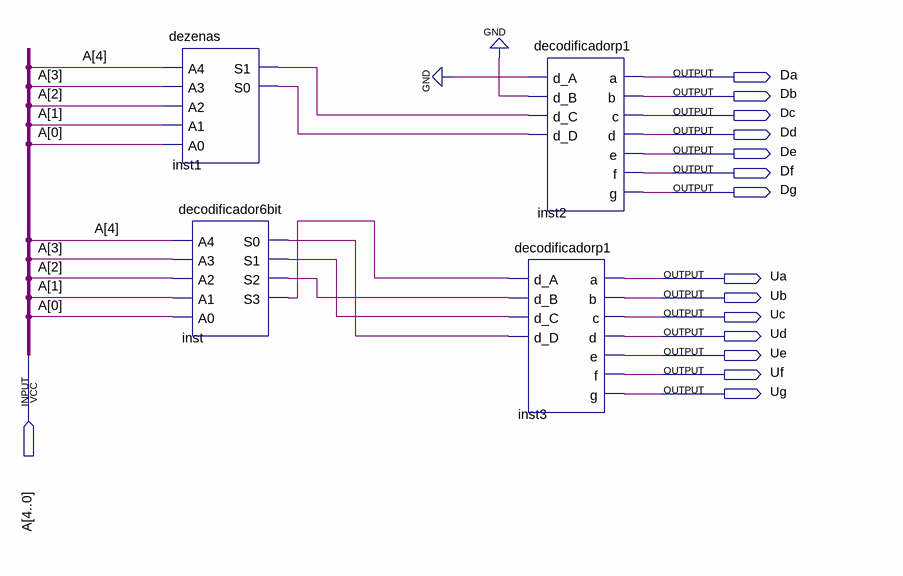
[diagram p0: schematic sheet]
// Quartus schematic DecodificadorCompleto.bdf as structural Verilog: 4 symbols, 15 pins
module DecodificadorCompleto (
  input  [4:0] A,
  output Da,
  output Db,
  output Dc,
  output Dd,
  output De,
  output Df,
  output Dg,
  output Ua,
  output Ub,
  output Uc,
  output Ud,
  output Ue,
  output Uf,
  output Ug
);

  wire inst1_s0, inst1_s1, inst_s0, inst_s1, inst_s2, inst_s3;

  dezenas inst1 (.A4(A[4]), .A3(A[3]), .A2(A[2]), .A1(A[1]), .A0(A[0]), .S1(inst1_s1), .S0(inst1_s0));
  decodificador6bit inst (
    .A4(A[4]), .A3(A[3]), .A2(A[2]), .A1(A[1]), .A0(A[0]), .S0(inst_s0), .S1(inst_s1), .S2(inst_s2),
    .S3(inst_s3));
  decodificadorp1 inst2 (
    .d_A(1'b0), .d_B(1'b0), .d_C(inst1_s1), .d_D(inst1_s0), .a(Da), .b(Db), .c(Dc), .d(Dd), .e(De), .f(Df),
    .g(Dg));
  decodificadorp1 inst3 (
    .d_A(inst_s3), .d_B(inst_s2), .d_C(inst_s1), .d_D(inst_s0), .a(Ua), .b(Ub), .c(Uc), .d(Ud), .e(Ue),
    .f(Uf), .g(Ug));
endmodule
